# EAGLE design sif_mod (EAGLE 6.6.0)
Pulsar P3 Replacement Module 'Odin' made by Roy Schneider 2020
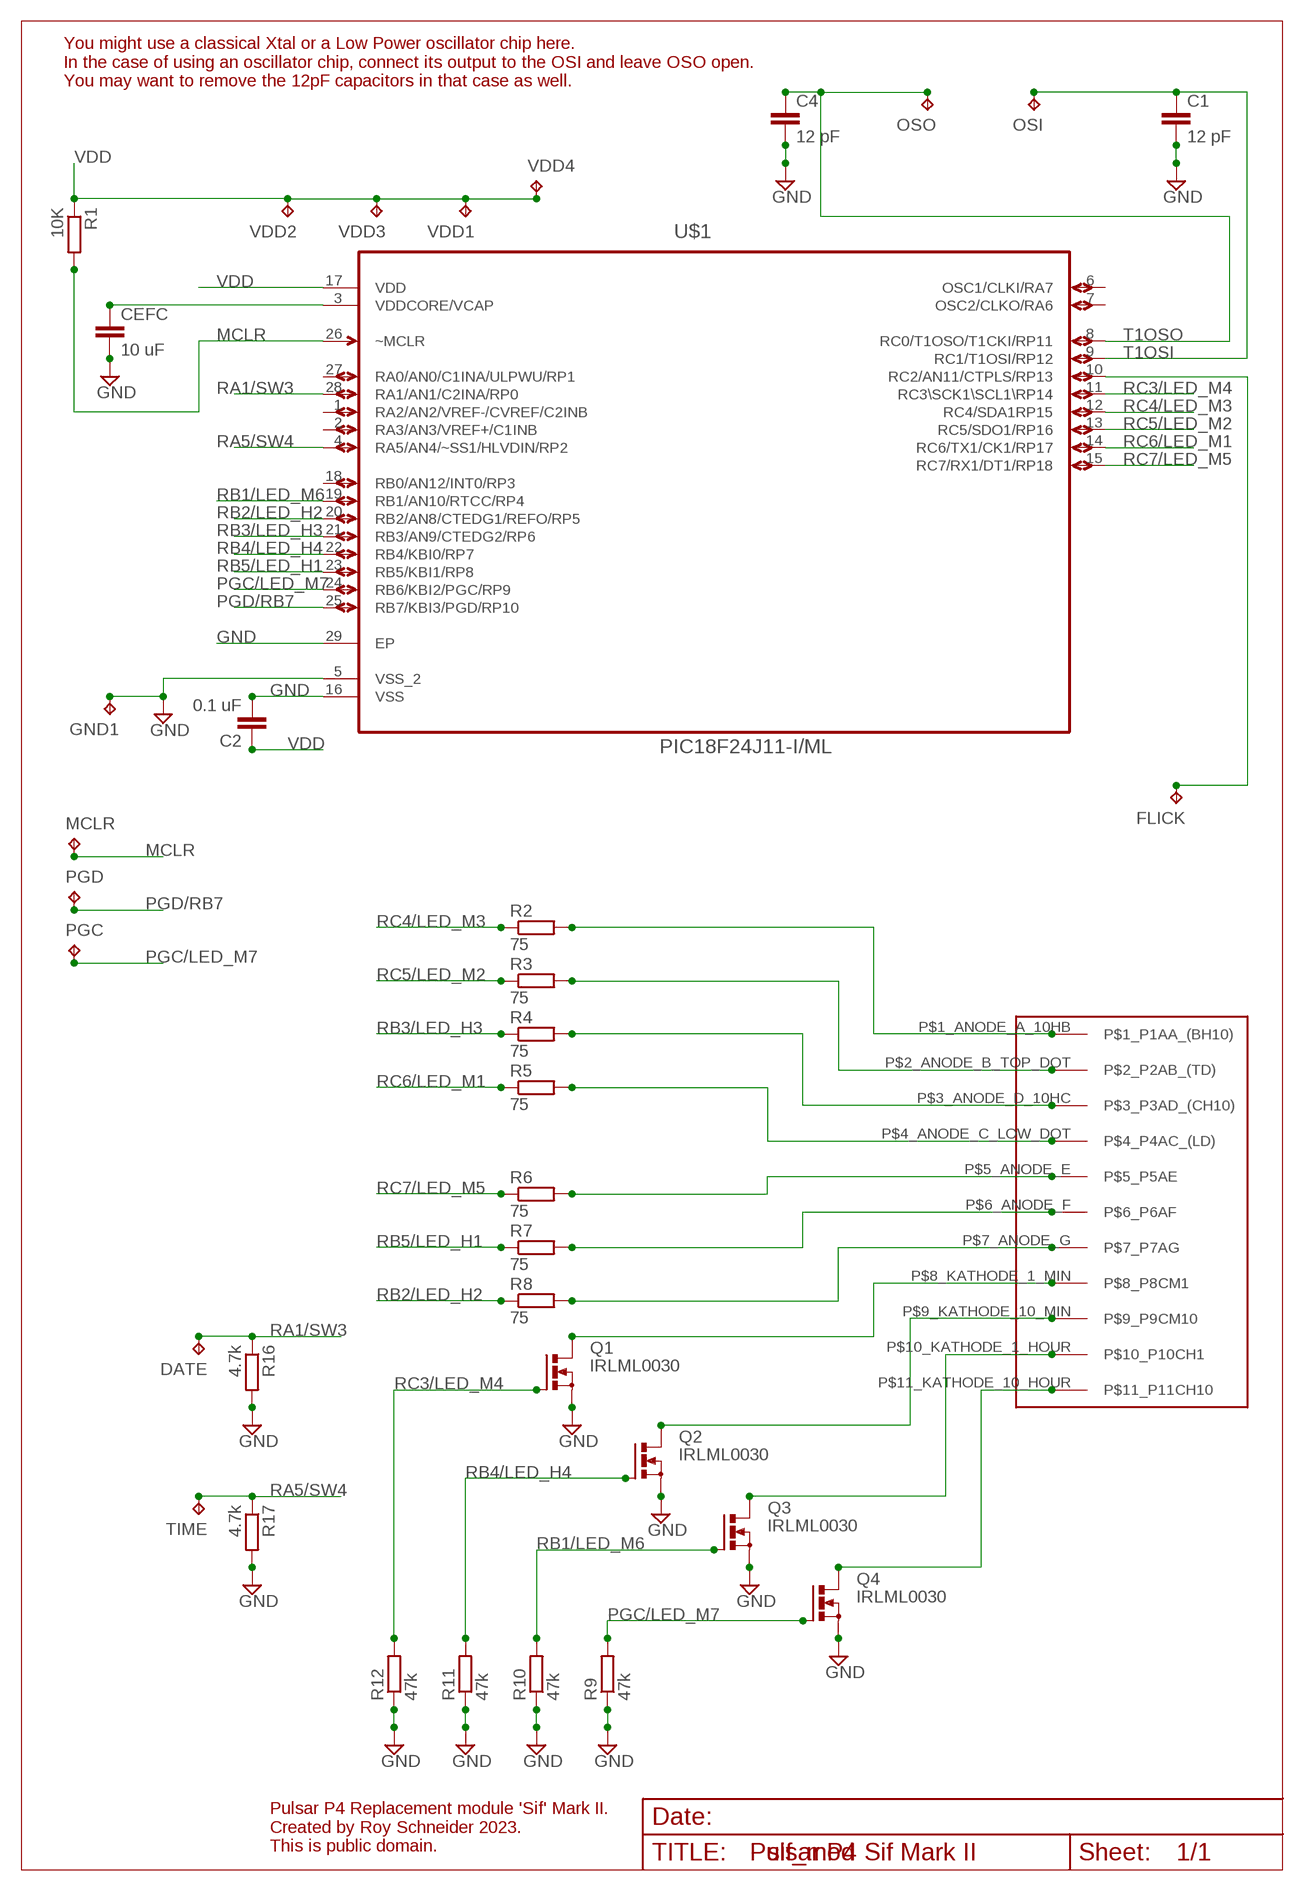
[diagram p0: schematic, sheet 1]

## Parts
C1  12 pF  C-EUC0402K  [C0402K]
C2  0.1 uF  C-EUC0402K  [C0402K]
C4  12 pF  C-EUC0402K  [C0402K]
CEFC  10 uF  C-EUC0603  [C0603]
DATE  TPTP08SQ  [TP08SQ]
FLICK  TPTP08SQ  [TP08SQ]
GND1  TPTP08SQ  [TP08SQ]
MCLR  TPTP06SQ  [TP06SQ]
OSI  TPTP08SQ  [TP08SQ]
OSO  TPTP08SQ  [TP08SQ]
PGC  TPTP06SQ  [TP06SQ]
PGD  TPTP06SQ  [TP06SQ]
Q1  IRLML0030  [SOT-23]
Q2  IRLML0030  [SOT-23]
Q3  IRLML0030  [SOT-23]
Q4  IRLML0030  [SOT-23]
R1  10K  R-EU_R0402  [R0402]
R2  75  R-EU_R0402  [R0402]
R3  75  R-EU_R0402  [R0402]
R4  75  R-EU_R0402  [R0402]
R5  75  R-EU_R0402  [R0402]
R6  75  R-EU_R0402  [R0402]
R7  75  R-EU_R0402  [R0402]
R8  75  R-EU_R0402  [R0402]
R9  47k  R-EU_R0402  [R0402]
R10  47k  R-EU_R0402  [R0402]
R11  47k  R-EU_R0402  [R0402]
R12  47k  R-EU_R0402  [R0402]
R16  4.7k  R-EU_R0402  [R0402]
R17  4.7k  R-EU_R0402  [R0402]
TIME  TPTP08SQ  [TP08SQ]
U$1  PIC18F24J11-I/ML  [QFN65P600X600X100-29N]
U$2  PULSAR_P4_DISPLAYPULSAR_P4_LED_DISPLAY  [PULSAR_P3_LED_DISPLAY]
VDD1  TPTP08SQ  [TP08SQ]
VDD2  TPTP08SQ  [TP08SQ]
VDD3  TPTP08SQ  [TP08SQ]
VDD4  TPTP08SQ  [TP08SQ]

## Nets
GND: C1.2 C2.2 C4.2 CEFC.2 GND1.TP Q1.P2(S) Q2.P2(S) Q3.P2(S) Q4.P2(S) R9.1 R10.1 R11.1 R12.1 R16.2 R17.2 U$1.5(VSS_2) U$1.16(VSS) U$1.29(EP)
MCLR: MCLR.TP R1.2 U$1.26(~MCLR)
N$1: FLICK.TP U$1.10(RC2/AN11/CTPLS/RP13)
N$2: R8.2 U$2.P$7_ANODE_G(P$7_P7AG)
N$3: R7.2 U$2.P$6_ANODE_F(P$6_P6AF)
N$6: R6.2 U$2.P$5_ANODE_E(P$5_P5AE)
N$7: R5.2 U$2.P$4_ANODE_C_LOW_DOT(P$4_P4AC_(LD))
N$8: R4.2 U$2.P$3_ANODE_D_10HC(P$3_P3AD_(CH10))
N$9: R3.2 U$2.P$2_ANODE_B_TOP_DOT(P$2_P2AB_(TD))
N$10: R2.2 U$2.P$1_ANODE_A_10HB(P$1_P1AA_(BH10))
N$11: Q2.P3(D) U$2.P$9_KATHODE_10_MIN(P$9_P9CM10)
N$12: Q3.P3(D) U$2.P$10_KATHODE_1_HOUR(P$10_P10CH1)
N$13: Q4.P3(D) U$2.P$11_KATHODE_10_HOUR(P$11_P11CH10)
N$14: Q1.P3(D) U$2.P$8_KATHODE_1_MIN(P$8_P8CM1)
PGC/LED_M7: PGC.TP Q4.P1(G) R9.2 U$1.24(RB6/KBI2/PGC/RP9)
PGD/RB7: PGD.TP U$1.25(RB7/KBI3/PGD/RP10)
RA1/SW3: DATE.TP R16.1 U$1.28(RA1/AN1/C2INA/RP0)
RA5/SW4: R17.1 TIME.TP U$1.4(RA5/AN4/~SS1/HLVDIN/RP2)
RB1/LED_M6: Q3.P1(G) R10.2 U$1.19(RB1/AN10/RTCC/RP4)
RB2/LED_H2: R8.1 U$1.20(RB2/AN8/CTEDG1/REFO/RP5)
RB3/LED_H3: R4.1 U$1.21(RB3/AN9/CTEDG2/RP6)
RB4/LED_H4: Q2.P1(G) R11.2 U$1.22(RB4/KBI0/RP7)
RB5/LED_H1: R7.1 U$1.23(RB5/KBI1/RP8)
RC3/LED_M4: Q1.P1(G) R12.2 U$1.11(RC3\SCK1\SCL1\RP14)
RC4/LED_M3: R2.1 U$1.12(RC4/SDA1RP15)
RC5/LED_M2: R3.1 U$1.13(RC5/SDO1/RP16)
RC6/LED_M1: R5.1 U$1.14(RC6/TX1/CK1/RP17)
RC7/LED_M5: R6.1 U$1.15(RC7/RX1/DT1/RP18)
T1OSI: C1.1 OSI.TP U$1.9(RC1/T1OSI/RP12)
T1OSO: C4.1 OSO.TP U$1.8(RC0/T1OSO/T1CKI/RP11)
VDD: C2.1 R1.1 U$1.17(VDD) VDD1.TP VDD2.TP VDD3.TP VDD4.TP
VDDCORE/VCAP: CEFC.1 U$1.3(VDDCORE/VCAP)
Unconnected: U$1.1(RA2/AN2/VREF-/CVREF/C2INB) U$1.2(RA3/AN3/VREF+/C1INB) U$1.6(OSC1/CLKI/RA7) U$1.7(OSC2/CLKO/RA6) U$1.18(RB0/AN12/INT0/RP3) U$1.27(RA0/AN0/C1INA/ULPWU/RP1)

## Notes on the sheet
- You might use a classical Xtal or a Low Power oscillator chip here.
  In the case of using an oscillator chip, connect its output to the OSI and leave OSO open.
  You may want to remove the 12pF capacitors in that case as well.
- Pulsar P4 Replacement module 'Sif' Mark II.
  Created by Roy Schneider 2023.
  This is public domain.
- Pulsar P4 Sif Mark II

## Library data of the parts
C1 C2 C4 = resistor_mod:C-EU: CAPACITOR, European symbol
CEFC = rcl:C-EU: CAPACITOR, European symbol
DATE FLICK GND1 MCLR OSI OSO PGC PGD TIME VDD1-VDD4 = testpad:TP: Test pad
Q1-Q4 = irlml0030:IRLML0030: Nch MOSFET IRLML0030 30 V, 5,3 A, Rds(on) 0,022 Ohm, SOT-23 https://www.mouser.de/datasheet/2/196/Infineon_IRLML0030_DataSheet_v01_01_EN-3166591.pdf
R1-R12 R16 R17 = resistor_mod:R-EU_: RESISTOR, European symbol
U$1 = pic18f24j11:PIC18F24J11-I/ML: 8BIT MCU; DESCRIPTION: 8BIT MCU; MPN: PIC18F24J11-I/Ml; OC_FARNELL: 1707634; OC_NEWARK: 98M1764; PACKAGE: QFN-28; SUPPLIER: Microchip
U$2 = pulsar_p4_display:PULSAR_P4_DISPLAY: Vintage Pulsar P4 Display made by Litronix.

## Net classes
0 default: clearance 0.205 mm

## Board
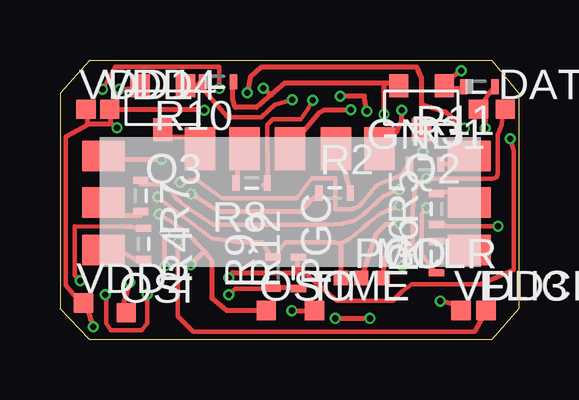
[diagram p1: board, top side]
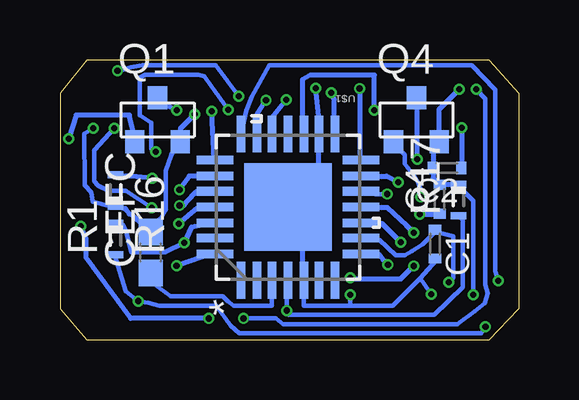
[diagram p2: board, bottom side, seen from below]

Size 19.11 x 11.65 mm. Coordinates in mm from the lower left corner, seen from the top.
Outline: 1.23,11.65 18,11.65 19.11,10.25 19.11,1.29 18,0 1.23,0 0,1.29 0,10.25 1.23,11.65
Copper layers (1*16): Top 0.035mm / dielectric 1.5mm / Bottom 0.035mm
Design rules "default *": minimum track width 6mil, minimum drill 10mil, track to track 3mil, track to pad 3mil, pad to pad 4mil, via to via 4mil, smd to smd 4mil, copper to edge 5mil, drill to drill 7mil, minimum pad ring 5mil, minimum via ring 4mil, stop-mask expansion 4mil, vias tented up to drill 0mil, thermal gap 5mil

### Footprints (pad centres in the part's own frame; a part is rotated, then mirrored left to right if it is on the bottom)
C0402K = smd 0.406 x 0.508: 1 -0.6,0; 2 0.6,0
C0603 = smd 1.1 x 1: 1 -0.85,0; 2 0.85,0
TP08SQ = smd 0.8 x 0.8: TP 0,0
TP06SQ = smd 0.6 x 0.6: TP 0,0
SOT-23 = smd 0.802 x 0.972: P1 -0.95,-0.917; P2 0.95,-0.917; P3 0,0.917
R0402 = smd 0.305 x 0.635: 1 -0.65,0; 2 0.65,0
QFN65P600X600X100-29N = smd 1.524 x 0.356: 1 -3.048,1.956; 2 -3.048,1.295; 3 -3.048,0.66; 4 -3.048,0; 5 -3.048,-0.66; 6 -3.048,-1.295; 7 -3.048,-1.956; 15 3.048,-1.956; 16 3.048,-1.295; 17 3.048,-0.66; 18 3.048,0; 19 3.048,0.66; 20 3.048,1.295; 21 3.048,1.956 | smd 0.356 x 1.524: 8 -1.956,-3.048; 9 -1.295,-3.048; 10 -0.66,-3.048; 11 0,-3.048; 12 0.66,-3.048; 13 1.295,-3.048; 14 1.956,-3.048; 22 1.956,3.048; 23 1.295,3.048; 24 0.66,3.048; 25 0,3.048; 26 -0.66,3.048; 27 -1.295,3.048; 28 -1.956,3.048 | smd 3.658 x 3.658: 29 0,0
PULSAR_P3_LED_DISPLAY = smd 1.27 x 1.778: P$1_ANODE_A_10HB 9.842,4.921; P$7_ANODE_G 6.032,4.921; P$8_KATHODE_1_MIN 11.668,4.921; P$9_KATHODE_10_MIN 7.938,4.921; P$10_KATHODE_1_HOUR 4.185,4.921 | smd 1.778 x 1.27: P$2_ANODE_B_TOP_DOT 15.399,4.61; P$3_ANODE_D_10HC 0.159,0.705; P$4_ANODE_C_LOW_DOT 15.399,2.689; P$5_ANODE_E 15.399,0.705; P$6_ANODE_F 0.159,2.689; P$11_KATHODE_10_HOUR 0.159,4.61

### Placement (x,y rotation side)
C1  3.49,3.97 270 bottom
C2  2.99,7.14 180 bottom
C4  3.29,5.84 90 bottom
CEFC  15.34,3.62 90 bottom
DATE  18.55,9.6 0 top
FLICK  17.75,1.21 0 top
GND1  17.44,9.6 180 top
MCLR  13.44,2.56 0 top
OSI  2.76,1.12 0 top
OSO  8.6,1.21 0 top
PGC  11.7,2.56 90 top
PGD  12.55,2.56 0 top
Q1  15.05,9.16 0 bottom
Q2  15.06,9.65 180 top
Q3  4.28,9.65 180 top
Q4  4.26,9.16 0 bottom
R1  16.8,4.18 90 bottom
R2  11.45,6.11 0 top
R3  15.22,7.3 0 top
R4  3.48,3.98 270 top
R5  15.69,5.44 90 top
R6  15.69,3.43 90 top
R7  3.37,5.98 270 top
R8  7.99,6.52 180 top
R9  8.88,2.78 90 top
R10  6.58,10.74 180 top
R11  17.47,10.54 180 top
R12  9.94,2.78 90 top
R16  16.8,6.21 270 bottom
R17  2.51,5.81 90 bottom
TIME  10.6,1.21 0 top
U$1  9.62,5.52 90 bottom
U$2  1.65,3.03 0 top
VDD1  1.08,9.59 0 top
VDD2  0.98,1.52 0 top
VDD3  16.71,1.21 0 top
VDD4  2.07,9.59 0 top

### Tracks (layer width: path | path; a pad name or v marks a point on that pad's centre or on a via)
GND  (via drill 0.25)
  Top 0.152: 14.11,10.3 Q2.P2 | 18.1,10.48 R11.1 | 3.31,10.27 Q3.P2 | 8.88,2.15 R9.1 8.8,2.12 | 9.92,2.15 R12.1 | v7.02,1.87 7.05,1.87
  Top 0.178: 7.19,10.77 7.21,10.87 R10.1 | 14.11,10.3 14.11,10.68 | 8.8,2.12 7.3,2.12 7.05,1.87 | v1.89,1.87 1.93,1.79 1.93,0.67 2.12,0.39 3.41,0.39 3.64,0.68 v3.64,1.88
  Top 0.203: 7.19,10.77 7.19,10.01 7.31,9.67 8.19,9.67 8.81,10.2 | 8.81,10.2 9.36,10.68 13.5,10.68 | 14.11,10.68 13.5,10.68 | 18.1,10.48 17.87,10.25 17.57,9.75 GND1.TP 17.59,9.43 17.72,9.11 v17.73,8.8 | v13.5,9.39 13.5,10.68 | 3.31,10.27 2.84,10.44 v2.48,10.43 | 9.92,2.15 8.88,2.15 | v8.46,10.47 8.81,10.2
  Bottom 0.152: 17.06,5.55 R16.2 | 14.11,8.47 Q1.P2 | 8.34,8.39 8.34,8.55 U$1.16 | U$1.29 9.59,5.45 | 3.31,6.46 C4.2 3.24,6.46 | 3.57,7.1 C2.2 | 2.53,6.46 R17.2 | 3.34,8.42 Q4.P2 3.31,8.5 | 8.95,2.45 U$1.5 9,2.53
  Bottom 0.178: 14.11,8.47 14.48,7.68 14.7,7.02 14.7,5.41 14.89,5.08 15.39,4.74 15.59,4.74 CEFC.2 | v17.73,8.8 18.1,8.57 18.09,6.44 17.82,6.13 17.75,5.74 17.02,5.56 | 3.54,8.22 3.34,8.42 | 4.1,2.55 5.24,1.41 7.02,1.41 | 4.1,2.55 3.44,3.31 | 7.02,1.41 8.96,1.41 8.95,2.45 | 7.02,1.41 v7.02,1.87 | 2.5,6.39 1.89,5.78 v1.89,1.87 | 4.1,2.55 v3.64,1.88 | 9,4.86 9.59,5.45
  Bottom 0.203: 17.06,5.55 16.65,5.55 16.39,5.45 16.23,5.23 16.07,5.16 CEFC.2 | 17.02,5.56 R16.2 | v13.5,9.39 14.08,8.8 14.08,8.55 Q1.P2 | 8.34,8.39 8.34,6.64 U$1.29 | 3.31,6.46 3.57,6.72 3.57,7.1 | 3.24,6.46 2.53,6.46 | 3.54,8.22 3.54,7.18 C2.2 | v2.48,10.43 3.31,9.59 3.31,8.5 | 3.44,3.31 C1.2 | 2.5,6.39 R17.2 | 9,2.53 9,4.86 | v8.46,10.47 8.31,9.1 U$1.16
MCLR  (via drill 0.25)
  Top 0.203: v13.93,4.03 13.66,3.7 13.52,3.37 MCLR.TP
  Bottom 0.152: 12.69,4.84 U$1.26
  Bottom 0.178: 16.86,4.81 16.52,4.8 16.34,4.49 16.14,3.63 14.74,3.63 v13.93,4.03 | 16.87,4.82 R1.2
  Bottom 0.203: v13.93,4.03 13.64,4.68 12.69,4.84 | 16.86,4.81 16.87,4.82
N$1  (via drill 0.25)
  Top 0.178: FLICK.TP 17.29,0.33 16.04,0.33 5.55,0.33 4.91,0.96 v4.91,4.05
  Bottom 0.152: 6.57,4.84 U$1.10
  Bottom 0.203: v4.91,4.05 5.7,4.84 6.57,4.84
N$2
  Top 0.152: 7.39,6.73 R8.2 | 7.66,7.94 U$2.P$7_ANODE_G
  Top 0.203: 7.39,6.73 7.39,7.12 7.66,7.94
N$3
  Top 0.152: 1.82,5.7 U$2.P$6_ANODE_F
  Top 0.178: 1.82,5.7 1.82,5.17
  Top 0.203: 1.82,5.17 3.37,5.17 R7.2
N$6
  Top 0.152: 17.03,4.25 17.03,3.75 U$2.P$5_ANODE_E
  Top 0.203: 17.03,4.25 16.29,4.08 R6.2
N$7
  Top 0.152: 17.03,5.73 U$2.P$4_ANODE_C_LOW_DOT
  Top 0.203: 17.03,5.73 16.93,6.12 15.74,6.13 R5.2
N$8
  Top 0.152: U$2.P$3_ANODE_D_10HC
  Top 0.203: U$2.P$3_ANODE_D_10HC 2.5,3.72 3.12,3.33 R4.2
N$9
  Top 0.152: 17.03,7.3 17.03,7.63 U$2.P$2_ANODE_B_TOP_DOT | 15.89,7.3 R3.2
  Top 0.203: 17.03,7.3 15.89,7.3
N$10
  Top 0.152: 11.49,7.94 U$2.P$1_ANODE_A_10HB
  Top 0.203: 11.49,7.94 11.63,7.36 11.85,7.06 R2.2
N$11  (via drill 0.25)
  Top 0.152: 15.18,8.32 15.07,8.45 Q2.P3 | 9.59,7.99 9.59,7.96 U$2.P$9_KATHODE_10_MIN
  Top 0.203: v15.12,7.82 15.18,8.32 | v12.11,9.57 11.03,9.57 10.81,9.46 9.59,7.99
  Bottom 0.178: v15.12,7.82 15.3,7.94 15.3,9.02 15.79,9.33 15.79,10.91 15.56,11.03 13.35,11.03 13.1,10.96 v12.11,9.57
N$12
  Top 0.152: 4.3,8.42 Q3.P3 | 5.83,7.96 U$2.P$10_KATHODE_1_HOUR
  Top 0.178: 5.83,7.96 5.83,8.42
  Top 0.203: 5.83,8.42 4.3,8.42
N$13  (via drill 0.25)
  Top 0.152: 1.82,7.51 U$2.P$11_KATHODE_10_HOUR
  Top 0.203: 1.82,7.51 v4.23,7.51
  Bottom 0.152: 4.23,10.2 4.28,10.25 Q4.P3
  Bottom 0.203: v4.23,7.51 4.23,10.2
N$14  (via drill 0.25)
  Top 0.152: 13.32,7.96 U$2.P$8_KATHODE_1_MIN
  Top 0.203: v14.24,9.55 14.24,9.12 14.03,8.67 13.32,7.96
  Bottom 0.152: 15.05,10.3 Q1.P3
  Bottom 0.203: 15.05,10.3 14.94,9.9 v14.24,9.55
PGC/LED_M7  (via drill 0.25)
  Top 0.152: 8.85,3.44 R9.2 8.95,3.44 | 11.68,4 11.61,3.98 | 11.7,2.58 PGC.TP
  Top 0.178: v4.08,5.94 5.13,5.11 6.33,4.23 7.4,4.05 7.93,4.06 8.44,4.06 8.78,3.44 R9.2 | v14.13,5.58 13.34,5.25 12.87,4.87 12.51,4.54 12,4.15 11.68,4 11.7,3.92 | 8.95,3.44 9.38,4.06 11.46,4.06 11.61,3.98
  Top 0.203: 11.7,3.92 11.7,2.58
  Bottom 0.152: Q4.P1 5.22,8.42 5.22,8.16 | 12.69,6.17 U$1.24 12.72,6.24
  Bottom 0.178: 5.22,8.16 4.75,7.7 4.75,7.33 4.62,7.15 4.37,6.85 4.19,6.54 4.08,6.23 v4.08,5.94
  Bottom 0.203: v14.13,5.58 13.95,5.59 13.51,6.08 13.43,6.16 13.2,6.24 12.72,6.24
PGD/RB7  (via drill 0.25)
  Top 0.203: v14.17,4.83 13.58,4.79 13.16,4.38 PGD.TP
  Bottom 0.152: 12.69,5.5 U$1.25
  Bottom 0.178: 12.69,5.5 13.39,5.47
  Bottom 0.203: 13.39,5.47 v14.17,4.83
RA1/SW3  (via drill 0.25)
  Top 0.178: v14.26,3.07 14.69,4.03 14.69,5.42 14.71,5.62 14.76,5.96 14.78,6.2 14.89,6.47 15.14,6.69 v15.27,6.73 15.35,6.69 18.02,6.69 18.19,6.76 18.23,6.94 18.23,8.52 18.4,8.95 18.44,9.17 DATE.TP
  Bottom 0.152: 12.69,3.62 12.69,3.57 U$1.28
  Bottom 0.178: 16.58,6.83 R16.1
  Bottom 0.203: 16.58,6.83 15.92,6.79 v15.27,6.73 | 12.69,3.62 v14.26,3.07
RA5/SW4  (via drill 0.25)
  Top 0.203: v9.66,1.21 TIME.TP
  Bottom 0.152: 2.5,5.14 R17.1 | 9.61,2.45 U$1.4 9.64,2.37
  Bottom 0.178: 2.5,5.14 2.33,4.99 2.33,2.17 3.53,1.03 9.6,1.03 9.66,1.08 v9.66,1.21 9.66,1.73 9.64,1.76 9.64,2.37
RB1/LED_M6  (via drill 0.25)
  Top 0.178: 5.75,10.66 5.37,10.27 5.24,10.27 Q3.P1 | 5.75,10.66 6.01,10.91 R10.2 | 5.75,10.66 7,9.25 8.39,9.25 8.95,9.78 v9.68,9.99
  Bottom 0.152: U$1.19
  Bottom 0.203: v9.68,9.99 10.27,9.26 U$1.19
RB2/LED_H2  (via drill 0.25)
  Top 0.178: v10.53,9.97 10.32,9.59 10.02,9.17 8.87,9.17 8.64,8.94 8.65,6.59 8.47,6.41 R8.1
  Bottom 0.152: U$1.20
  Bottom 0.203: v10.53,9.97 10.91,9.36 U$1.20
RB3/LED_H3  (via drill 0.25)
  Top 0.152: 0.83,2.48 v0.85,2.45
  Top 0.178: 3.3,4.62 2.98,4.69 2.73,4.71 0.62,4.71 0.62,2.69 0.83,2.48
  Top 0.203: 3.3,4.62 R4.1
  Bottom 0.152: U$1.21
  Bottom 0.178: v0.85,2.45 0.98,2.84 0.98,10.4 1.96,11.42 10.39,11.42 11.11,10.11 11.36,9.52 U$1.21
RB4/LED_H4  (via drill 0.25)
  Top 0.152: 16.8,10.48 R11.2 | 16.01,10.3 Q2.P1
  Top 0.178: 16.01,10.3 16.01,10.48 | 15.96,10.53 Q2.P1
  Top 0.203: 16.01,10.48 16.8,10.48 | 15.96,10.53 16.22,10.85 v16.72,11.2 | v11.67,10.14 12.68,10.14 v12.79,9.51
  Bottom 0.152: 12.69,7.48 U$1.22
  Bottom 0.178: v11.67,10.14 12.62,11.42 15.68,11.42 16.17,11.34 16.47,11.24 v16.72,11.2
  Bottom 0.203: 12.69,7.48 v12.79,9.51
RB5/LED_H1  (via drill 0.25)
  Top 0.152: 3.37,6.47 R7.1
  Top 0.178: v14.13,6.25 13.48,5.99 12.65,5.21 12.27,4.95 11.72,4.81 11.08,4.79 6.38,4.79 5.85,5.13 5.34,5.46 5.09,5.65 4.81,5.94 4.63,6.16 4.61,6.18 4.33,6.47 3.37,6.47
  Bottom 0.203: U$1.23 13.73,6.81 v14.13,6.25
RC3/LED_M4  (via drill 0.25)
  Top 0.152: R12.2 9.89,3.37 | 9.94,3.01 9.89,3.01
  Top 0.178: v18.76,8.37 18.9,7.87 18.9,2.91 17.54,2.31 14.66,2.31 14.26,2.02 14.08,1.83 13.89,1.6 11.54,1.6 11.1,1.99 10.93,2.14 10.79,2.26 9.94,3.01
  Top 0.203: v4.37,3.06 v4.37,4.45 | 9.89,3.37 9.89,3.01 9.89,2.88 9.87,2.79 7.2,2.79 v7.02,2.58
  Bottom 0.152: 16.01,8.5 Q1.P1 | 6.57,5.5 U$1.11
  Bottom 0.203: v18.76,8.37 18.44,9.35 16.22,9.35 16.01,8.5 | 6.57,5.5 5.48,5.5 4.66,4.74 v4.37,4.45 | v4.37,3.06 4.91,2.53 7.02,2.53 v7.02,2.58
RC4/LED_M3  (via drill 0.25)
  Top 0.203: v5.47,6.06 5.68,5.95 6.61,5.35 10.06,5.34 10.52,5.85 R2.1
  Bottom 0.152: 6.57,6.16 6.53,6.09
  Bottom 0.203: 6.53,6.09 v5.47,6.06 | 6.57,6.16 U$1.12
RC5/LED_M2  (via drill 0.25)
  Top 0.178: v5.01,6.55 5.65,6.67 6.76,5.89 9.85,5.89 10.49,6.72 11.46,6.72 11.46,5.42 12.18,5.42 12.44,5.54 12.66,5.76 12.96,6.13 13.16,6.39 13.4,6.52 14.07,6.78 14.24,6.9 14.38,7.12 R3.1
  Bottom 0.203: U$1.13 5.51,6.81 v5.01,6.55
RC6/LED_M1  (via drill 0.25)
  Top 0.152: 1.79,10.43 v1.77,10.43
  Top 0.178: v18.25,4.71 16.12,4.71 15.89,4.82 15.49,4.81 R5.1 | v6.63,10.46 6.63,11.36 2.3,11.36 1.79,10.43
  Top 0.203: v11.47,0.88 v12.92,0.88
  Bottom 0.178: v11.47,0.88 10.13,0.88 9.82,0.64 2.57,0.64 1.84,1.18 1.41,1.52 1.28,1.93 1.4,2.28 1.4,10.03 v1.77,10.43 | 6.6,7.48 U$1.14
  Bottom 0.203: v18.25,4.71 18.02,4.18 18.02,3.41 16.17,0.88 v12.92,0.88 | v6.63,10.46 6.6,10.49 6.6,7.48
RC7/LED_M5  (via drill 0.25)
  Top 0.178: v15.28,5.49 15.08,5.22 15.08,3.6 15.46,2.98 R6.1
  Top 0.203: v16.85,8.8 16.07,9.49 15.05,9.81 15.05,10.89 14.85,11.36 8.41,11.36 7.93,10.94 v7.81,10.28
  Bottom 0.152: 7.68,8.57 U$1.15
  Bottom 0.178: v15.28,5.49 16.37,6.21 17.08,6.21 17.51,6.41 17.69,6.6 17.69,7.89 v16.85,8.8
  Bottom 0.203: v7.81,10.28 7.68,10 7.68,8.57
T1OSI  (via drill 0.25)
  Top 0.203: v2.91,2.38 2.67,1.56 2.68,1.21 OSI.TP
  Bottom 0.152: 3.47,4.5 C1.1 | 6.57,4.2 U$1.9
  Bottom 0.178: 3.48,4.5 4.01,3.96 4.45,3.67 4.74,3.52 5.12,3.52 5.8,4.16 6.57,4.2 | 3.48,4.5 3.47,4.5 | v2.91,2.38 2.73,2.58 2.73,4.3 3.48,4.5
T1OSO  (via drill 0.25)
  Top 0.178: v4.13,5.22 4.64,4.91 5.22,4.51 6.01,3.7 5.96,3.64 5.96,3.62
  Top 0.203: 6.01,3.7 6.34,3.25 6.34,1.7 6.95,1.21 OSO.TP | 5.96,3.62 v5.45,3.11
  Bottom 0.152: 3.31,5.22 C4.1 | 6.57,3.54 U$1.8
  Bottom 0.203: v4.13,5.22 3.31,5.22 | 6.57,3.54 5.81,3.54 5.65,3.31 v5.45,3.11
VDD  (via drill 0.25)
  Top 0.152: 1.1,9.59 VDD1.TP
  Top 0.178: 2.1,9.59 VDD4.TP | 2.04,8.98 2.1,9.03 | 1.18,1.16 VDD2.TP 1.13,1.21 0.24,2.26 0.24,8.46 1.21,8.98 1.16,9.03 | 1.16,9.54 1.1,9.59
  Top 0.203: v15.85,1.6 16.33,1.5 VDD3.TP | v2.37,8.82 2.1,9.03 2.1,9.59 | 2.04,8.98 1.21,8.98 | v6.01,9.56 5.98,9.53 5.78,9.6 2.18,9.6 VDD4.TP | v1.38,0.53 1.32,0.69 1.18,1.16 | 1.16,9.03 1.16,9.54
  Bottom 0.152: 2.37,7.12 C2.1 | 9.02,8.6 U$1.17
  Bottom 0.178: R1.1 16.8,3.37 16.37,2 v15.85,1.6 15.44,1.54 14.98,1.41 12.61,1.41 11.99,0.57 11.64,0.25 1.56,0.25 v1.38,0.53
  Bottom 0.203: v2.37,8.82 2.37,7.12 | 9.02,8.6 9.02,10.83 8.69,11.02 6.01,11.02 v6.01,9.56
VDDCORE/VCAP
  Bottom 0.152: 10.3,2.45 U$1.3
  Bottom 0.178: 10.3,2.45 10.3,1.41 11.88,1.41 12.12,1.59 12.33,1.81 14.5,1.81 15.42,2.48 CEFC.1